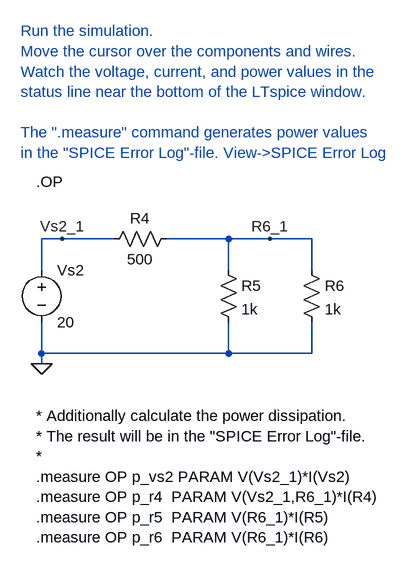
[diagram p0: schematic op_power1.asc]
op_power1.asc, the LTspice schematic file:
Version 4
SHEET 1 880 680
WIRE -144 160 -144 112
WIRE -144 288 -144 240
WIRE -144 304 -144 288
WIRE -112 112 -144 112
WIRE -32 112 -112 112
WIRE 144 112 48 112
WIRE 144 160 144 112
WIRE 144 288 -144 288
WIRE 144 288 144 240
WIRE 208 112 144 112
WIRE 272 112 208 112
WIRE 272 160 272 112
WIRE 272 288 144 288
WIRE 272 288 272 240
FLAG -144 304 0
FLAG 208 112 R6_1
FLAG -112 112 Vs2_1
SYMBOL voltage -144 144 R0
SYMATTR InstName Vs2
SYMATTR Value 20
SYMBOL res -48 128 R270
WINDOW 0 32 56 VTop 0
WINDOW 3 0 56 VBottom 0
SYMATTR InstName R4
SYMATTR Value 500
SYMBOL res 128 144 R0
SYMATTR InstName R5
SYMATTR Value 1k
SYMBOL res 256 144 R0
SYMATTR InstName R6
SYMATTR Value 1k
TEXT -152 24 Left 0 !.OP
TEXT -152 384 Left 0 !* Additionally calculate the power dissipation.\n* The result will be in the "SPICE Error Log"-file.\n*\n.measure OP p_vs2 PARAM V(Vs2_1)*I(Vs2)  \n.measure OP p_r4  PARAM V(Vs2_1,R6_1)*I(R4) \n.measure OP p_r5  PARAM V(R6_1)*I(R5)  \n.measure OP p_r6  PARAM V(R6_1)*I(R6)
TEXT -176 -208 Left 0 ;Run the simulation.\nMove the cursor over the components and wires.\nWatch the voltage, current, and power values in the \nstatus line near the bottom of the LTspice window.\n \nThe ".measure" command generates power values \nin the "SPICE Error Log"-file. View->SPICE Error Log

The netlist it stands for:
* op_power1.asc
Vs2 Vs2_1 0 20
R4 Vs2_1 R6_1 500
R5 R6_1 0 1k
R6 R6_1 0 1k
.OP
* Additionally calculate the power dissipation.
* The result will be in the "SPICE Error Log"-file.
*
.measure OP p_vs2 PARAM V(Vs2_1)*I(Vs2)
.measure OP p_r4  PARAM V(Vs2_1,R6_1)*I(R4)
.measure OP p_r5  PARAM V(R6_1)*I(R5)
.measure OP p_r6  PARAM V(R6_1)*I(R6)
* Run the simulation.
* Move the cursor over the components and wires.
* Watch the voltage, current, and power values in the
* status line near the bottom of the LTspice window.
* The ".measure" command generates power values
* in the "SPICE Error Log"-file. View->SPICE Error Log
.backanno
.end